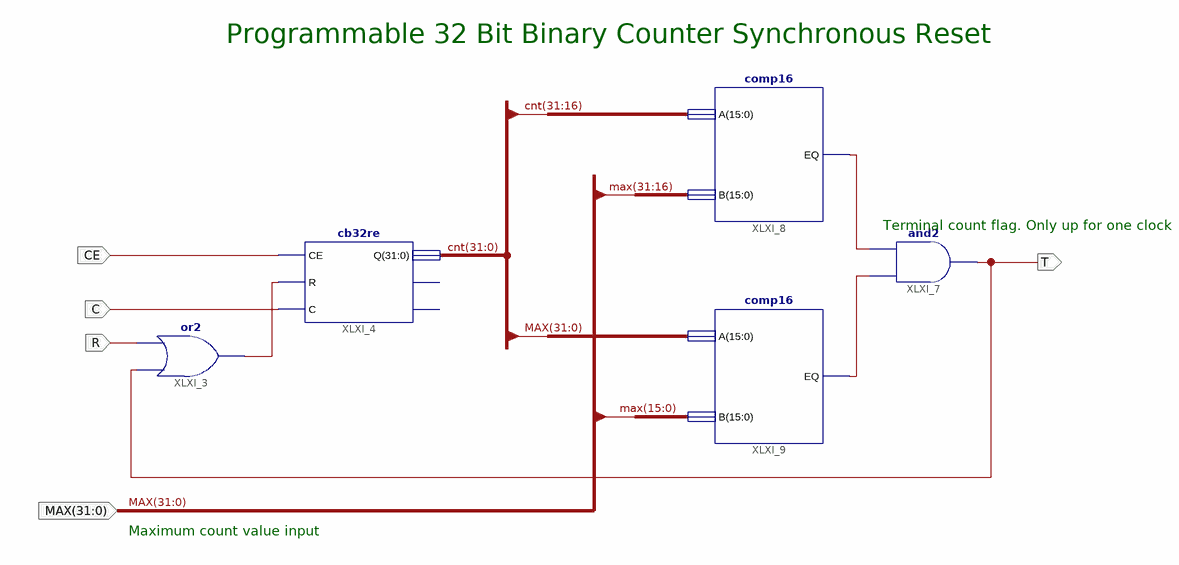
[diagram p0: schematic sheet 1]
// Xilinx ISE schematic pcb32re.sch (spartan6) as structural Verilog: 5 symbols, 5 ports
module pcb32re (
  input  CE,
  input  C,
  input  [31:0] MAX,
  input  R,
  output T
);

  wire XLXN_2, XLXN_6, XLXN_7;
  wire [31:0] cnt;

  cb32re XLXI_4 (.C(C), .CE(CE), .Q(cnt), .R(XLXN_2));  // open: CEO, TC
  comp16 XLXI_8 (.A(cnt[31:16]), .B(MAX[31:16]), .EQ(XLXN_6));
  comp16 XLXI_9 (.A(MAX), .B(MAX[15:0]), .EQ(XLXN_7));
  and XLXI_7 (T, XLXN_7, XLXN_6);
  or XLXI_3 (XLXN_2, T, R);

  // Notes on the sheet:
  //   Programmable 32 Bit Binary Counter Synchronous Reset
  //   Terminal count flag. Only up for one clock
  //   Maximum count value input
endmodule
